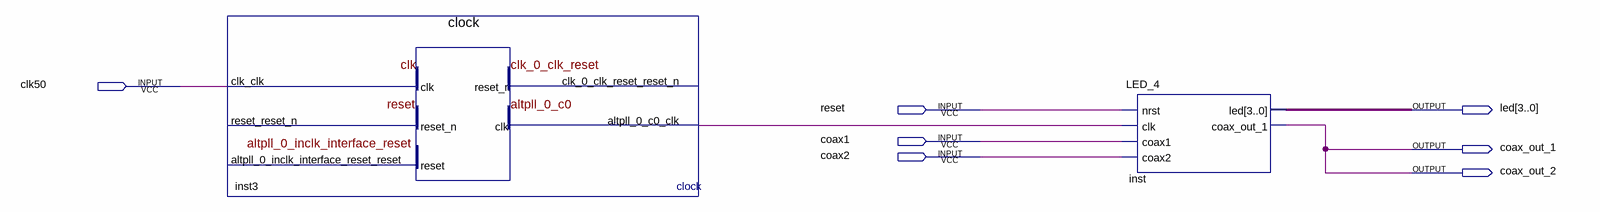
[diagram p0: schematic sheet]
// Quartus schematic coincidence.bdf as structural Verilog: 2 symbols, 7 pins
module coincidence (
  input  clk50,
  input  reset,
  input  coax1,
  input  coax2,
  output [3:0] led,
  output coax_out_1,
  output coax_out_2
);

  wire inst3_altpll_0_c0_clk;

  clock inst3 (
    .clk_clk(clk50), .altpll_0_c0_clk(inst3_altpll_0_c0_clk));  // open: reset_reset_n, altpll_0_inclk_interface_reset_reset, clk_0_clk_reset_reset_n
  LED_4 inst (
    .nrst(reset), .clk(inst3_altpll_0_c0_clk), .coax1(coax1), .coax2(coax2), .coax_out_1(coax_out_1),
    .led(led));

  assign coax_out_2 = coax_out_1;
endmodule
